# EAGLE design draft4-modular-split (EAGLE 7.6.4)
COMPANY: Ekta Labs; COPYRIGHT: 2016; DRAWN: Karl Palsson; REV: A
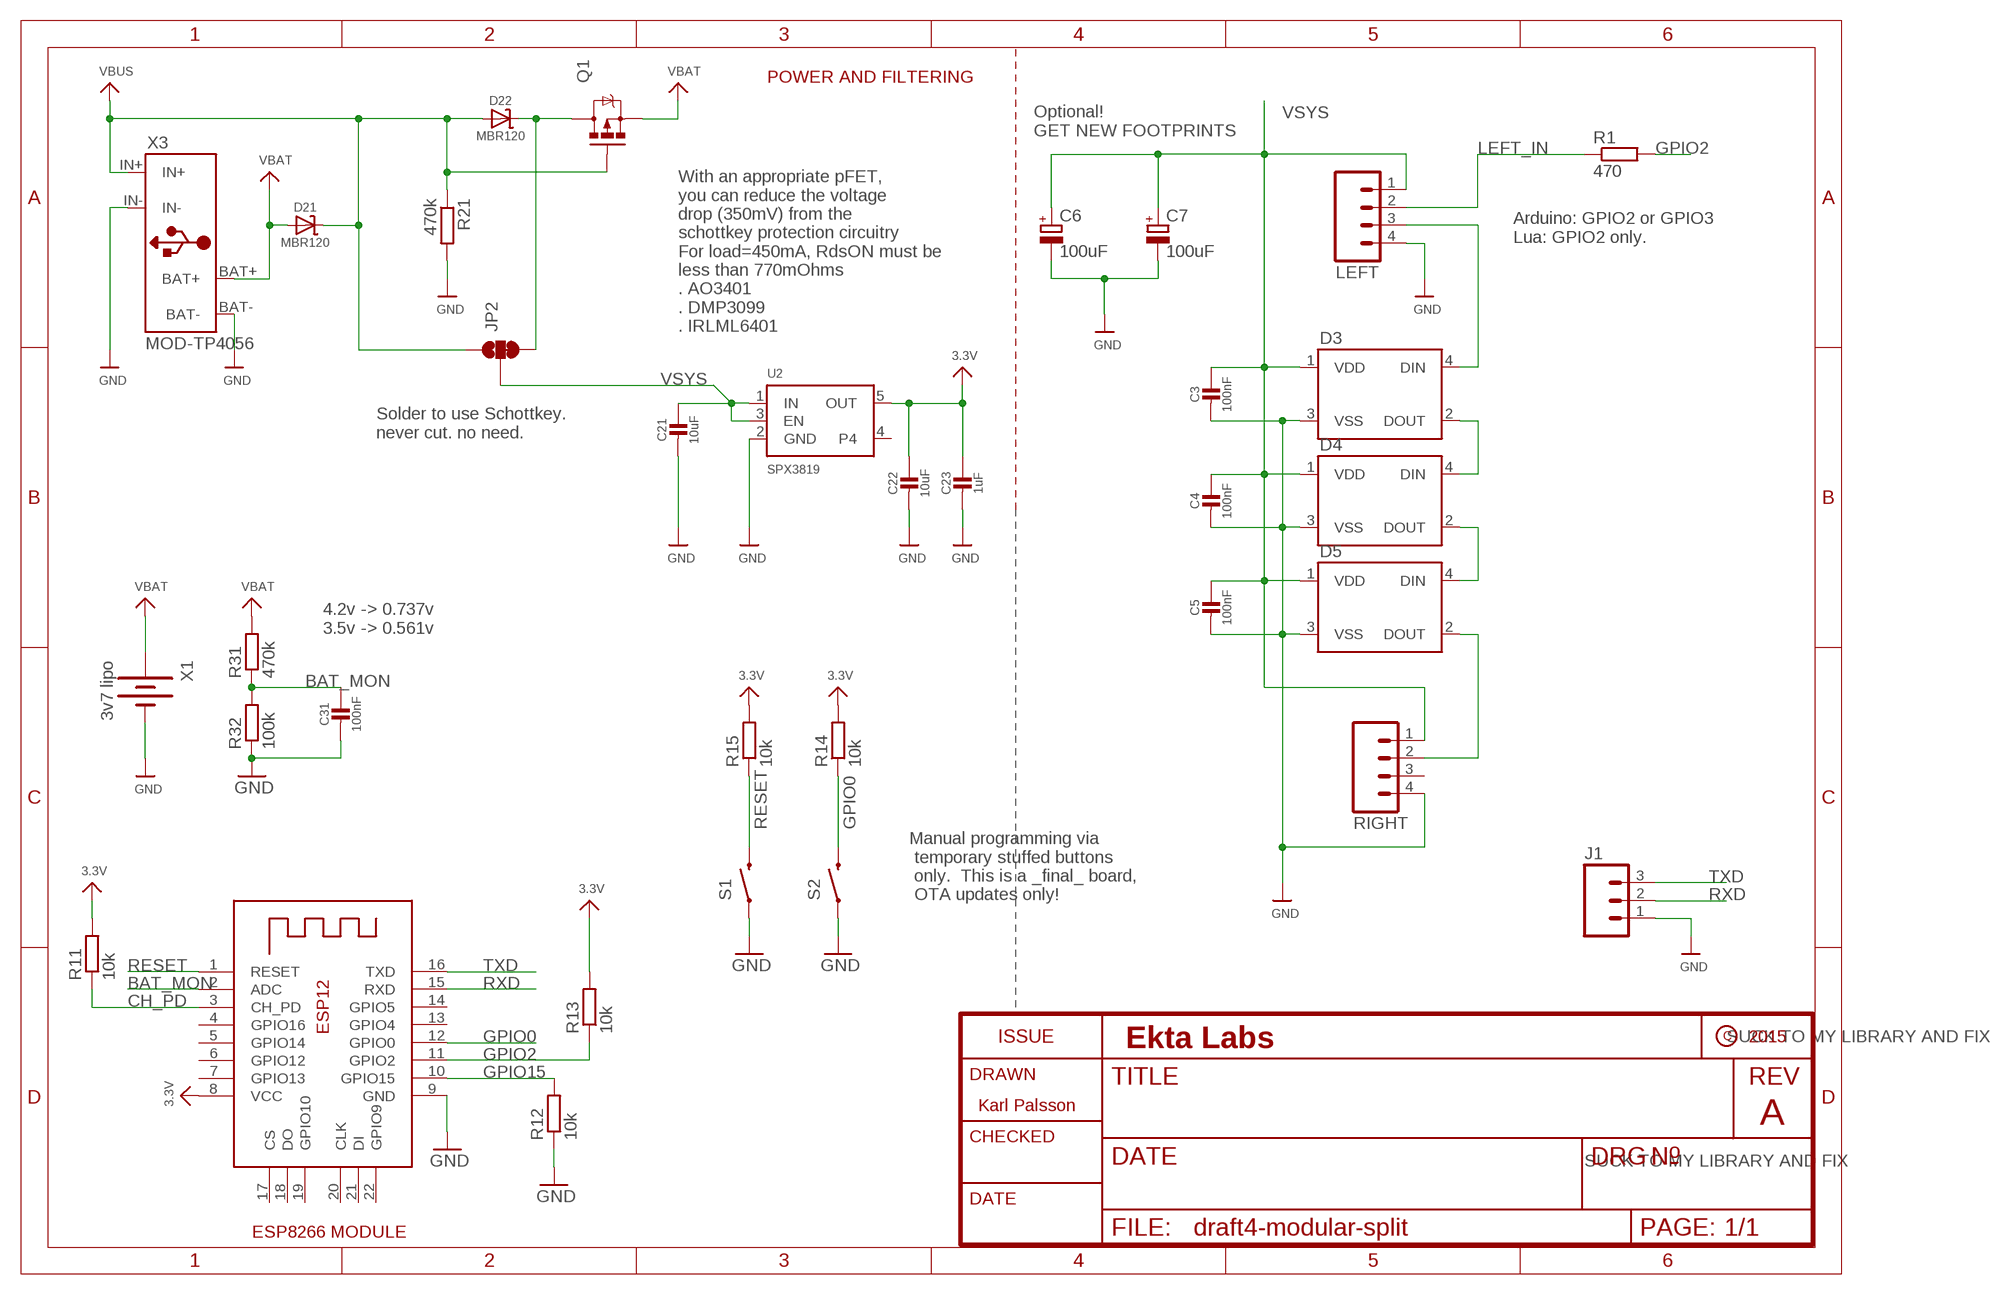
[diagram p0: schematic, sheet 1]

## Parts
C3  100nF  CAP_CERAMIC0805-NOOUTLINE  [0805-NO]
C4  100nF  CAP_CERAMIC0805-NOOUTLINE  [0805-NO]
C5  100nF  CAP_CERAMIC0805-NOOUTLINE  [0805-NO]
C6  100uF  CPOL-EUB  [PANASONIC_B]
C7  100uF  CPOL-EUB  [PANASONIC_B]
C21  10uF  CAP_CERAMIC0805-NOOUTLINE  [0805-NO]
C22  10uF  CAP_CERAMIC0805-NOOUTLINE  [0805-NO]
C23  1uF  CAP_CERAMIC0805-NOOUTLINE  [0805-NO]
C31  100nF  CAP_CERAMIC0805-NOOUTLINE  [0805-NO]
D3  WS2812B  [WS2812B]
D4  WS2812B  [WS2812B]
D5  WS2812B  [WS2812B]
D21  MBR120  DIODE-SCHOTTKYSOD-123  [SOD-123]
D22  MBR120  DIODE-SCHOTTKYSOD-123  [SOD-123]
J1  M031X03_NO_SILK  [1X03_NO_SILK]
JP2  JUMPER-PAD-3-2OF3_NC_BY_TRACE_LARGE  [PAD-JUMPER-3-2OF3_NC_BY_TRACE_YES_SILK_LARGE]
LEFT  M041X04_NO_SILK  [1X04_NO_SILK]
Q1  MOSFET-PCHANNEL  [SOT23-3]
R1  470  R-EU_R0603  [R0603]
R11  10k  R-EU_R0603  [R0603]
R12  10k  R-EU_R0603  [R0603]
R13  10k  R-EU_R0603  [R0603]
R14  10k  R-EU_R0603  [R0603]
R15  10k  R-EU_R0603  [R0603]
R21  470k  R-EU_R0603  [R0603]
R31  470k  R-EU_R0603  [R0603]
R32  100k  R-EU_R0603  [R0603]
RIGHT  M041X04_NO_SILK  [1X04_NO_SILK]
S1  SWITCH-MOMENTARY-2PTH  [TACTILE-PTH]
S2  SWITCH-MOMENTARY-2PTH  [TACTILE-PTH]
U2  SPX3819  VREG_SOT23-5  [SOT23-5]
X1  3v7 lipo  BATTERY18650-BLOSSOM  [BATT-18650-BLOSSOM-1]
X2  ESP-12  ESP-12E  [ESP-12E]
X3  MOD-TP4056  MOD-LIPO_CHARGER  [MOD-LIPO_CHARGER]

## Nets
3.3V: C22.1 C23.1 R11.2 R13.2 R14.2 R15.2 U2.5(OUT) X2.8(VCC)
BAT_MON: C31.1 R31.1 R32.2 X2.2(ADC)
CH_PD: R11.1 X2.3(CH_PD)
D3_IN: D3.4(DIN) LEFT.3
D4_IN: D3.2(DOUT) D4.4(DIN)
D5_IN: D4.2(DOUT) D5.4(DIN)
GND: C3.2 C4.2 C5.2 C6.- C7.- C21.2 C22.2 C23.2 C31.2 D3.3(VSS) D4.3(VSS) D5.3(VSS) J1.1 LEFT.4 R12.1 R21.2 R32.1 RIGHT.4 S1.1 S2.1 U2.2(GND) X1.- X2.9(GND) X3.BAT- X3.IN-
GPIO0: R14.1 S2.3 X2.12(GPIO0)
GPIO2: R1.2 R13.1 X2.11(GPIO2)
GPIO15: R12.2 X2.10(GPIO15)
LEFT_IN: LEFT.2 R1.1
N$3: D22.C JP2.3 Q1.3(D)
RESET: R15.1 S1.3 X2.1(RESET)
RIGHT_IN: D5.2(DOUT) RIGHT.2
RXD: J1.2 X2.15(RXD)
TXD: J1.3 X2.16(TXD)
VBAT: D21.A Q1.2(S) R31.2 X1.+ X3.BAT+
VBUS: D21.C D22.A JP2.1 Q1.1(G) R21.1 X3.IN+
VSYS: C3.1 C4.1 C5.1 C6.+ C7.+ C21.1 D3.1(VDD) D4.1(VDD) D5.1(VDD) JP2.2 LEFT.1 RIGHT.1 U2.1(IN) U2.3(EN)
Unconnected: RIGHT.3 U2.4 X2.4(GPIO16) X2.5(GPIO14) X2.6(GPIO12) X2.7(GPIO13) X2.13(GPIO4) X2.14(GPIO5) X2.17(CS) X2.18(DO) X2.19(GPIO10) X2.20(CLK) X2.21(DI) X2.22(GPIO9)

## Notes on the sheet
- POWER AND FILTERING
- Optional!
  GET NEW FOOTPRINTS
- Arduino: GPIO2 or GPIO3
  Lua: GPIO2 only.
- With an appropriate pFET,
  you can reduce the voltage
  drop (350mV) from the
  schottkey protection circuitry
  For load=450mA, RdsON must be
  less than 770mOhms
  . AO3401
  . DMP3099
  . IRLML6401
- Solder to use Schottkey.
  never cut. no need.
- 4.2v -> 0.737v
  3.5v -> 0.561v
- Manual programming via
   temporary stuffed buttons
   only.  This is a _final_ board,
   OTA updates only!
- SUCK TO MY LIBRARY AND FIX
- SUCK TO MY LIBRARY AND FIX
- ESP8266 MODULE

## Library data of the parts
C3-C5 C21-C23 C31 = microbuilder:CAP_CERAMIC: Ceramic Capacitors For new designs, use the packages preceded by an '_' character since they are more reliable: The following footprints should be used on most boards: _0402 - Standard footprint for regular board layouts _0603 - Standard footprint for regular board layouts _0805 - Standard footprint for regular board layouts _1206 - Standard footprint for regular board layouts For extremely tight-pitch boards where space is at a premium, the following 'micro-pitch' footprints can be used (smaller pads, no silkscreen outline, etc.): _0402MP - Micro-pitch footprint for very dense/compact boards _0603MP - Micro-pitch footprint for very dense/compact boards _0805MP - Micro-pitch footprint for very dense/compact boards _1206MP - Micro-pitch footprint for very dense/compact boards
C6 C7 = rcl:CPOL-EU: POLARIZED CAPACITOR, European symbol
D3-D5 = karls-parts-2016-09:WS2812B: WS2812B - Intelligent control LED integrated light source Technical Specifications: Power Supply Voltage (VDD): 3.5 to 5.3 V Input Voltage (VI): -0.5 to VDD+0.5 V Operating Junction Temperature (Topt): -25°C to +80°C Storage Temperature Range (Tstg): -55°C to +150°C; PROD_ID: DIO-12503
D21 D22 = microbuilder:DIODE-SCHOTTKY
J1 = SparkFun-Connectors:M03: Header 3 Standard 3-pin 0.1" header. Use with straight break away headers (SKU : PRT-00116), right angle break away headers (PRT-00553), swiss pins (PRT-00743), machine pins (PRT-00117), and female headers (PRT-00115). Molex polarized connector foot print use with SKU : PRT-08232 with associated crimp pins and housings.
JP2 = SparkFun-Passives:JUMPER-PAD-3-2OF3_NC_BY_TRACE
LEFT RIGHT = SparkFun-Connectors:M04: Header 4 Standard 4-pin 0.1" header. Use with straight break away headers (SKU : PRT-00116), right angle break away headers (PRT-00553), swiss pins (PRT-00743), machine pins (PRT-00117), and female headers (PRT-00115). Molex polarized connector foot print use with SKU : PRT-08231 with associated crimp pins and housings. 1MM SMD Version SKU: PRT-10208; PROD_ID: CONN-09696
Q1 = SparkFun-DiscreteSemi:MOSFET-PCHANNEL: Generic PMOSFET IRLML2244 - TRANS-11153 (SOT-23 -20V -4.3A) (1.Gate 2.Source 3.Drain) FQP27P06 - COM-10349 <http://www.sparkfun.com/products/10349> (TO-220 -60V -27A) (1.Gate 2.Source 3.Drain); PROD_ID: TRANS-08285
R1 R11-R15 R21 R31 R32 = resistor:R-EU_: RESISTOR, European symbol
S1 S2 = SparkFun-Electromechanical:SWITCH-MOMENTARY-2: Various NO switches- pushbuttons, reed, etc; PROD_ID: SWCH-08441
U2 = microbuilder:VREG_SOT23-5: SOT23-5 Fixed Voltage Regulators Part Current Out V Out V In V Dropout θJA (°C/W) TJ (°C) Digikey Part No. ADP121 150mA 3.3V 3.4-5.5V 0.09V @ 150mA -- -- ADP121-AUJZ33R7CT-ND ADP121 150mA 3.0V 3.1-5.5V 0.09V @ 150mA -- -- ADP121-AUJZ30R7CT-ND ADP122 300mA 3.3V 3.4-5.5V 0.085V @ 300mA -- -- ADP122AUJZ-3.3-R7CT-ND ADP1712 300mA 3.3V 3.5-5.5V 0.17V @ 300mA -- -- ADP1712AUJZ-3.3-R7TR-ND AP7311 (Low Cost) 150mA 3.3V 3.5-6V 0.15V @ 150mA -- -- AP7311-33WG-7DICT-ND LD39015M18R 150mA 1.8V 1.9V-5.5V 0.08V @ 100mA -- -- 497-6977-1-ND LP2985A-33DBVR 150mA 3.3V 3.3-16V 0.28V @ 150mA 206 150 296-18479-1-ND MCP1824T-3302E/OT 300mA 3.3V 3.5V-6V 0.2V @ 300mA -- -- MCP1824T-3302E/OTCT-ND MIC5205-2.5YM5 TR 150mA 2.5V 2.7-16V 0.165V @ 150mA -- -- 576-1257-2-ND MIC5205-3.0YM5 TR 150mA 3.0V 3.2V-16V 0.165V @ 150mA -- -- 576-1258-2-ND MIC5205-3.3YM5 TR 150mA 3.3V 3.5V-16V 0.165V @ 150mA -- -- 576-1259-2-ND TPS780330220 150mA 3.3V+2.2V 3.6-5.5V 250mV Max -- -- 296-23332-1-ND TDA3663/N1,135 100mA 3.3V 3.5-45V 0.18V @ 50mA -- -- 568-5343-1-ND Max operating temp can be calculated using θJA, TJ (max junction temperature), and power in watts. Set the "Maximum Ambient Temperature" until it reaches TJ ("Max Junction Temperature"), which is the absolute limit for safe use of the regulator: Heat Sink Temperature Calculator <http://www.daycounter.com/Calculators/Heat-Sink-Temperature-Calculator.phtml> For example, With 12V source into a 3.3V LP2985 and a 30mA load, we are dissipating (12V-3.3V) * 0.03A = 0.261W. With a θJA of 206 °C/W, a TJ of 150°C, and 261mW we can safely use the chip without a heat sink up to 75°C (=147.1°C Junction Temperature).
X1 = karls-parts-2016-09:BATTERY
X2 = microbuilder:ESP-12E
X3 = karls-parts-2016-09:MOD-LIPO_CHARGER: TP4056 USB Battery Charger module

## Board
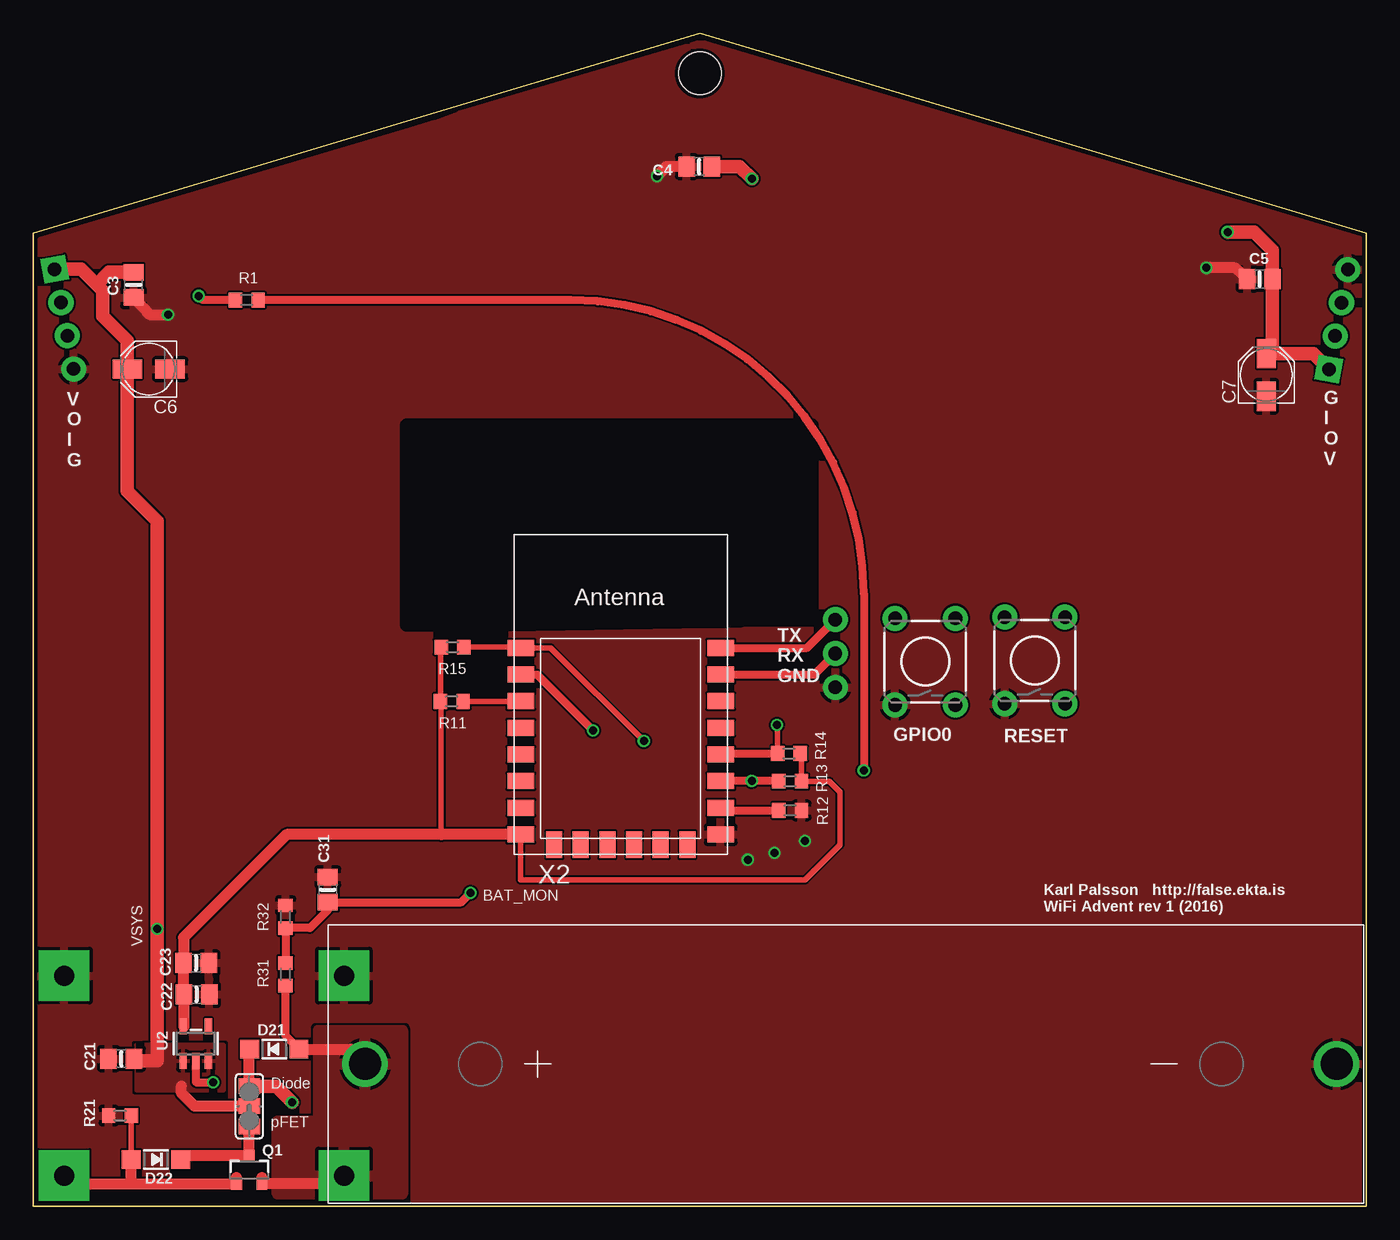
[diagram p1: board, top side]
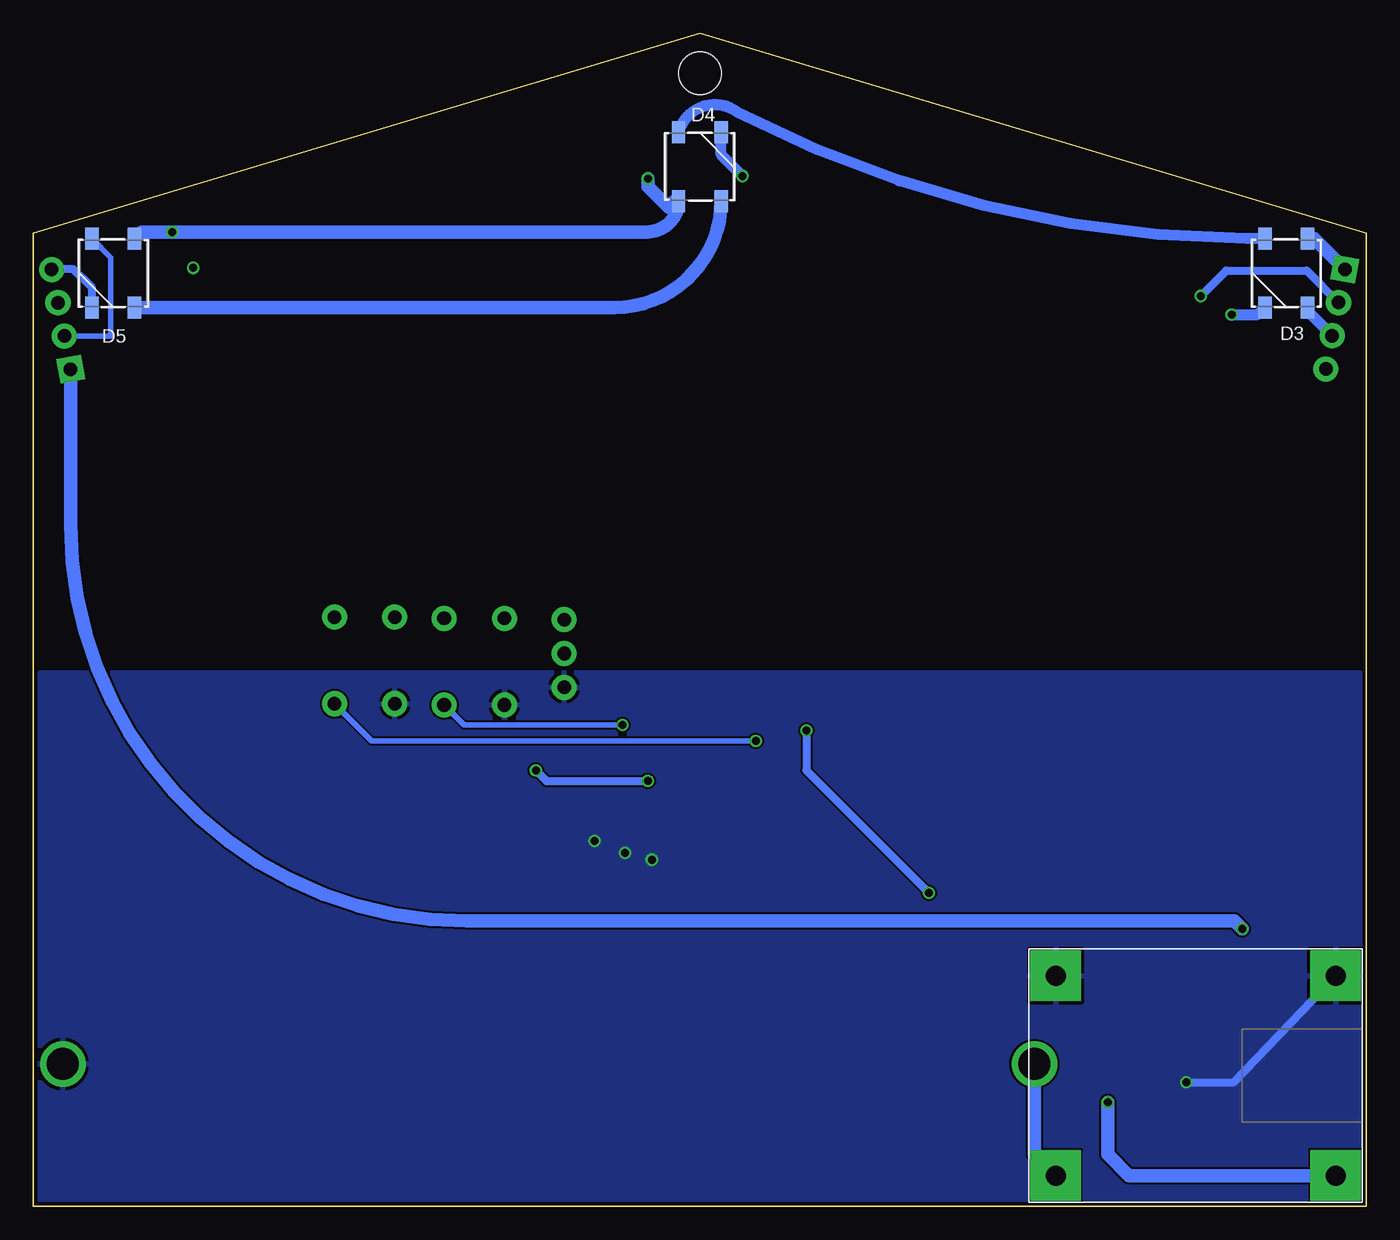
[diagram p2: board, bottom side, seen from below]

Size 100 x 88 mm. Coordinates in mm from the lower left corner, seen from the top.
Outline: 0,8.89 0,2.54
Outline: 0,0 100,0 100,73 50,88 0,73 0,0
Copper layers (1*16): Top 0.035mm / dielectric 1.5mm / Bottom 0.035mm
Design rules "SeeedStudio_2layer_DRU_no_angle_20140221": minimum track width 6mil, minimum drill 12mil, track to track 6mil, track to pad 6mil, pad to pad 6mil, via to via 6mil, smd to smd 0mil, copper to edge 10mil, drill to drill 10mil, minimum pad ring 10mil, minimum via ring 6mil, stop-mask expansion 2mil, vias tented up to drill 100mil, thermal gap 10mil
Holes 3.2 mm at 50,85
tRestrict: area 28,43.6 to 58.4,58.6

### Footprints (pad centres in the part's own frame; a part is rotated, then mirrored left to right if it is on the bottom)
0805-NO = smd 1.24 x 1.5: 1 -0.95,0; 2 0.95,0
PANASONIC_B = smd 2.2 x 1.4: + 1.6,0; - -1.6,0
WS2812B = smd 1.651 x 1: 1 -2.577,1.6; 2 -2.577,-1.6; 3 2.577,-1.6; 4 2.577,1.6
SOD-123 = smd 1.4 x 1.4: A 1.85,0; C -1.85,0
1X03_NO_SILK = drill 1.016 pad 1.88: 1 0,0; 2 2.54,0; 3 5.08,0
PAD-JUMPER-3-2OF3_NC_BY_TRACE_YES_SILK_LARGE = smd 1.168 x 1.6: 1 -1.524,0; 2 0,0; 3 1.524,0
1X04_NO_SILK = drill 1.016 pad 1.88 square: 1 0,0 | drill 1.016 pad 1.88: 2 2.54,0; 3 5.08,0; 4 7.62,0
SOT23-3 = smd 0.8 x 0.9: 1 -0.95,-1; 2 0.95,-1; 3 0,1.1
R0603 = smd 1 x 1.1: 1 -0.85,0; 2 0.85,0
TACTILE-PTH = drill 1.016 pad 1.88: 1 -3.251,2.261; 2 3.251,2.261; 3 -3.251,-2.261; 4 3.251,-2.261
SOT23-5 = smd 0.55 x 1.2: 1 -0.95,-1.3; 2 0,-1.3; 3 0.95,-1.3; 4 0.95,1.3; 5 -0.95,1.3
BATT-18650-BLOSSOM-1 = drill 2.4: + 36.45,0; - -36.45,0
ESP-12E = smd 2 x 1.2: 1 -7.5,5.77; 2 -7.5,3.77; 3 -7.5,1.77; 4 -7.5,-0.23; 5 -7.5,-2.23; 6 -7.5,-4.23; 7 -7.5,-6.23; 8 -7.5,-8.23; 9 7.5,-8.23; 10 7.5,-6.23; 11 7.5,-4.23; 12 7.5,-2.23; 13 7.5,-0.23; 14 7.5,1.77; 15 7.5,3.77; 16 7.5,5.77 | smd 1.2 x 2: 17 -5,-9; 18 -3,-9; 19 -1,-9; 20 1,-9; 21 3,-9; 22 5,-9
MOD-LIPO_CHARGER = drill 1.5 pad 3.81 square: BAT+ 7,-10; BAT- -8,-10; IN+ 7,11; IN- -8,11

### Placement (x,y rotation side)
C3  7.52,69.12 270 top
C4  49.96,78 180 top
C5  92.02,69.56 180 top
C6  8.66,62.8 180 top
C7  92.5,62.37 90 top
C21  6.6,11.06 180 top
C22  12.25,15.89 0 top
C23  12.22,18.24 0 top
C31  22.1,23.75 90 top
D3  6,70 270 bottom
D4  50,78 90 bottom
D5  94,70 270 bottom
D21  18.08,11.78 0 top
D22  9.2,3.5 180 top
J1  60.18,38.93 90 top
JP2  16.2,7.5 270 top
LEFT  1.6,70.3 259.2 bottom
Q1  16.2,2.7 0 top
R1  16.02,67.98 0 top
R11  31.4,37.87 180 top
R12  56.78,29.7 180 top
R13  56.78,31.88 0 top
R14  56.7,33.97 0 top
R15  31.45,41.95 180 top
R21  6.5,6.8 180 top
R31  18.92,17.4 270 top
R32  18.92,21.72 270 top
RIGHT  97.2,62.8 79.2 top
S1  75.14,40.95 90 top
S2  66.92,40.86 90 top
U2  12.19,12.19 0 top
X1  61.34,10.67 180 top
X2  44.07,36.12 0 top
X3  13.3,9.3 270 bottom

### Tracks (layer width: path | path; a pad name or v marks a point on that pad's centre or on a via)
3.3V
  Top 0.406: U2.5 11.3,13.49 | C22.1 11.27,15.89 | 30.6,27.89 30.6,37.82 R11.2 30.55,41.89 R15.2 | X2.8 36.57,24.5 57.9,24.5 60.5,27.1 60.5,31.1 59.72,31.88 R13.2 57.63,33.89 R14.2
  Top 0.813: 11.3,13.49 C22.1 | X2.8 30.6,27.89 18.99,27.89 11.27,20.17 C23.1 11.27,15.89
BAT_MON  (via drill 0.6)
  Top 0.406: C31.1 22.1,22.2
  Top 0.61: R31.1 R32.2 20.77,20.87 22.1,22.2 | X2.2 37.81,39.89 v42,35.7 | C31.1 32.1,22.8 v32.8,23.5
  Bottom 0.61: v42,35.7 42,32.7 v32.8,23.5
CH_PD
  Top 0.406: X2.3 36.55,37.87 R11.1
D3_IN
  Bottom 0.813: D3.4 4.4,67.16 LEFT.3
D4_IN
  Bottom 0.813: D3.2 9,72.6 arc27 47.2,82.1 arc-110 D4.4
D5_IN
  Bottom 1.016: D5.4 56.4,67.42 arc-90 D4.2
GND  (via drill 0.6)
  Top 0.61: U2.2 12.19,9.3 v13.5,9.3
  Top 0.813: C4.2 47.5,78 v46.8,77.3 | C3.2 8.73,66.9 v10.1,66.9 | C5.2 90.16,70.4 v88,70.4
  Bottom 0.61: v13.5,9.3 9.93,9.3 X3.IN- | D5.3 95.6,68.9 97,70.3 98.61,70.3 RIGHT.4
  Bottom 0.813: v46.8,77.3 48.4,78.9 D4.3 | v10.1,66.9 8.12,66.9 D3.3
  other vias: 53.6,26 55.6,26.5 57.9,27.4
  pour Top (rank 2): 0.5,72.4 0.5,0.5 99.5,0.5 99.5,72.5 50.1,87.2 32,81.9 30.2,81.2 27.9,80.5
  pour Bottom: 0.5,40 0.5,0.5 99.5,0.5 99.5,40
GPIO0  (via drill 0.6)
  Top 0.406: X2.12 51.64,33.97 | v55.8,36.1 55.85,36.05 R14.1
  Top 0.61: 51.64,33.97 R14.1
  Bottom 0.406: S2.3 67.67,36.1 v55.8,36.1
GPIO2  (via drill 0.6)
  Top 0.406: X2.11 51.63,31.83 | v53.9,31.9 v53.89,31.89 | R13.1 55.91,31.9
  Top 0.61: v62.3,32.7 62.3,46 arc90 40.32,67.98 R1.2 | v53.89,31.89 X2.11 | 55.91,31.9 v53.9,31.9
  Bottom 0.61: v62.3,32.7 61.5,31.9 v53.9,31.9
GPIO15
  Top 0.406: X2.10 51.76,29.7
  Top 0.61: 51.76,29.7 R12.2
LEFT_IN  (via drill 0.6)
  Top 0.61: R1.1 12.72,67.98 v12.4,68.3
  Bottom 0.61: v12.4,68.3 10.5,70.2 4.47,70.2 LEFT.2
N$3
  Top 0.406: 11.35,3.8 arc90 D22.C
  Top 0.813: 11.35,3.8 Q1.3 JP2.3
RESET  (via drill 0.6)
  Top 0.406: R15.1 36.51,41.95 X2.1 38.81,41.89 v45.8,34.9
  Bottom 0.406: S1.3 74.6,34.9 v45.8,34.9
RIGHT_IN
  Bottom 0.406: RIGHT.2 94.2,65.3 94.2,71.18 D5.2
RXD
  Top 0.61: X2.15 58.6,39.89 J1.2
TXD
  Top 0.61: X2.16 58.06,41.89 J1.3
VBAT
  Top 0.61: D21.A 18.92,12.79 R31.2
  Top 0.813: 17.15,2.14 Q1.2 22.7,1.7 X3.BAT+ | D21.A 23.77,11.78 X1.+
  Bottom 1.016: X1.+ 24.89,3.89 X3.BAT+
  pour Top: 21.4,13.2 27.7,13.2 27.7,0.9 18.3,0.9 18.3,6.4 21.4,6.4
VBUS  (via drill 0.6)
  Top 0.406: D22.A R21.1 | 16.2,11.75 arc-90 D21.C
  Top 0.813: 15.25,2.14 Q1.1 7.3,1.7 | 16.2,11.75 JP2.1 16.22,9 | X3.IN+ 2.9,1.7 7.3,1.7 | D22.A 7.3,3.45 7.3,1.7
  Top 1.016: 16.22,9 18.2,9 v19.4,7.8
  Bottom 1.016: v19.4,7.8 19.4,3.9 17.8,2.3 X3.IN+
VSYS  (via drill 0.6)
  Top 0.406: C21.1 7.72,10.89
  Top 0.813: JP2.2 12.1,7.5 11.1,8.5 11.1,9
  Top 1.016: 7.72,10.89 9.3,10.89 v9.3,20.8 9.3,51.4 7.06,53.64 C6.+ 7.06,64.94 5.2,66.8 5.2,68.7 4.75,69.15 | 4.75,69.15 3.6,70.3 LEFT.1 | C3.1 5.67,70.07 4.75,69.15 | C4.1 53,78 v53.9,77.1 | v89.6,73.1 91.6,73.1 92.97,71.73 C5.1 92.97,64.43 C7.+ 96.03,63.97 RIGHT.1
  Bottom 1.016: D3.1 3.88,72.58 LEFT.1 | D5.1 91.88,73.1 v89.6,73.1 53.92,73.1 arc-90 D4.1 51.88,75.42 52.35,74.95 53.9,76.5 v53.9,77.1 | v9.3,20.8 9.9,21.4 67.5,21.4 arc90 97.2,51.1 RIGHT.1
  pour Top: 14.3,8.7 14.3,12.1 7.7,12.1 7.7,8.7

### Text on the board
tPlace: V / O / I / G | G / I / O / V | TX / RX / GND | GPIO0 | RESET | BAT_MON | Karl Palsson http://false.ekta.is / WiFi Advent rev 1 (2016) | VSYS | Diode | pFET